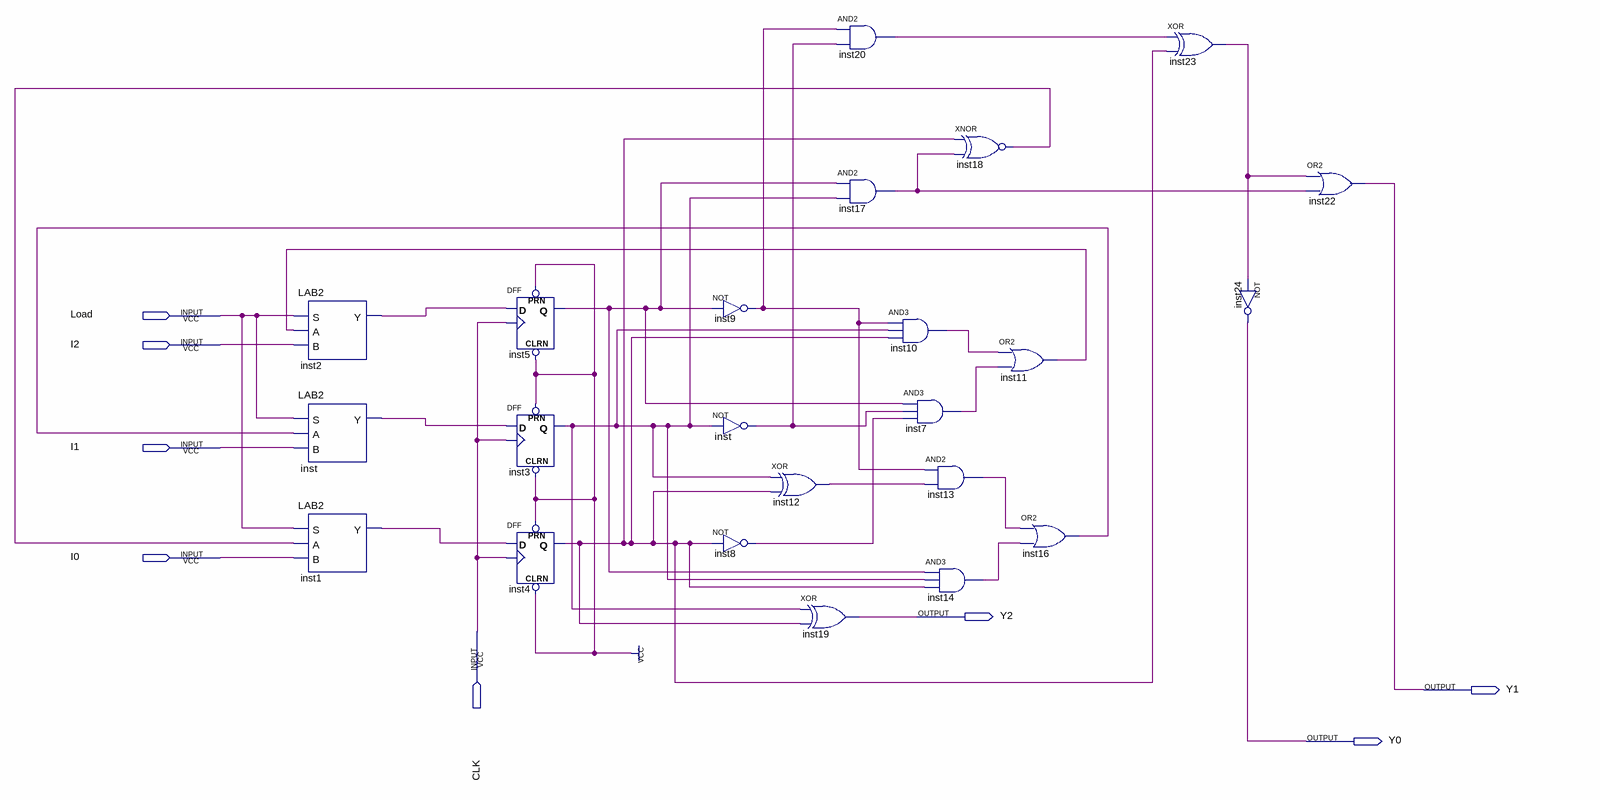
[diagram p0: schematic sheet]
// Quartus schematic Block2.bdf as structural Verilog: 23 symbols, 8 pins
module Block2 (
  input  Load,
  input  I2,
  input  I1,
  input  I0,
  input  CLK,
  output Y2,
  output Y1,
  output Y0
);

  wire inst1_y, inst2_y, inst3_q, inst4_q, inst5_q, inst7_out, inst8_out, inst9_out, inst10_out, inst11_out,
       inst12_out, inst13_out, inst14_out, inst16_out, inst17_out, inst18_out, inst20_out, inst23_out,
       inst_out, inst_y;

  LAB2 inst2 (.S(Load), .A(inst11_out), .B(I2), .Y(inst2_y));
  LAB2 inst (.S(Load), .A(inst16_out), .B(I1), .Y(inst_y));
  LAB2 inst1 (.S(Load), .A(inst18_out), .B(I0), .Y(inst1_y));
  DFF inst5 (.CLRN(1'b1), .CLK(CLK), .D(inst2_y), .PRN(1'b1), .Q(inst5_q));
  DFF inst3 (.CLRN(1'b1), .CLK(CLK), .D(inst_y), .PRN(1'b1), .Q(inst3_q));
  DFF inst4 (.CLRN(1'b1), .CLK(CLK), .D(inst1_y), .PRN(1'b1), .Q(inst4_q));
  not inst9 (inst9_out, inst5_q);
  not inst_dup2 (inst_out, inst3_q);
  not inst8 (inst8_out, inst4_q);
  xor inst12 (inst12_out, inst3_q, inst4_q);
  xor inst19 (Y2, inst3_q, inst4_q);
  and inst20 (inst20_out, inst9_out, inst_out);
  and inst17 (inst17_out, inst5_q, inst3_q);
  and inst10 (inst10_out, inst9_out, inst3_q, inst4_q);
  and inst7 (inst7_out, inst5_q, inst_out, inst8_out);
  and inst13 (inst13_out, inst9_out, inst12_out);
  and inst14 (inst14_out, inst5_q, inst3_q, inst4_q);
  xnor inst18 (inst18_out, inst4_q, inst17_out);
  or inst11 (inst11_out, inst10_out, inst7_out);
  or inst16 (inst16_out, inst13_out, inst14_out);
  xor inst23 (inst23_out, inst20_out, inst4_q);
  not inst24 (Y0, inst23_out);
  or inst22 (Y1, inst23_out, inst17_out);
endmodule
